# Altium project Spectre-Analyzer.PrjPcb
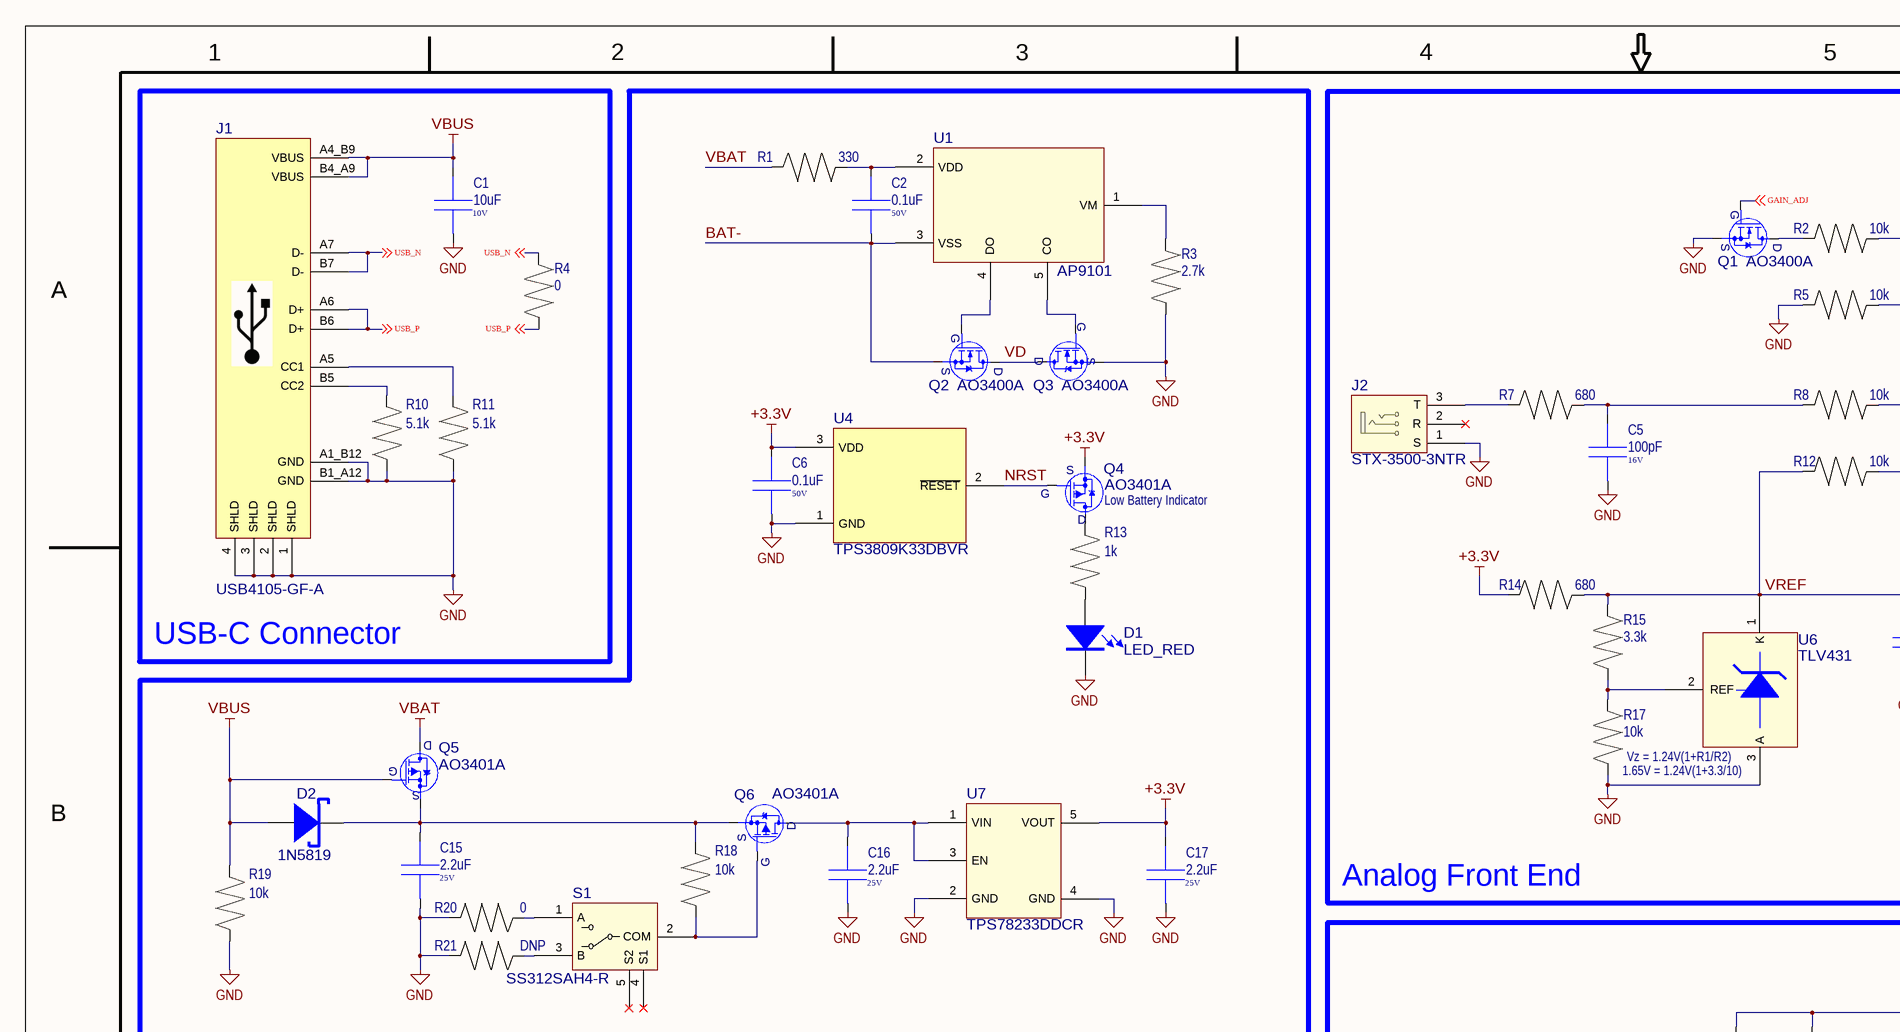
[diagram p0: Spectre-Analyzer-SCH_SH2_(C).SchDoc, top left]
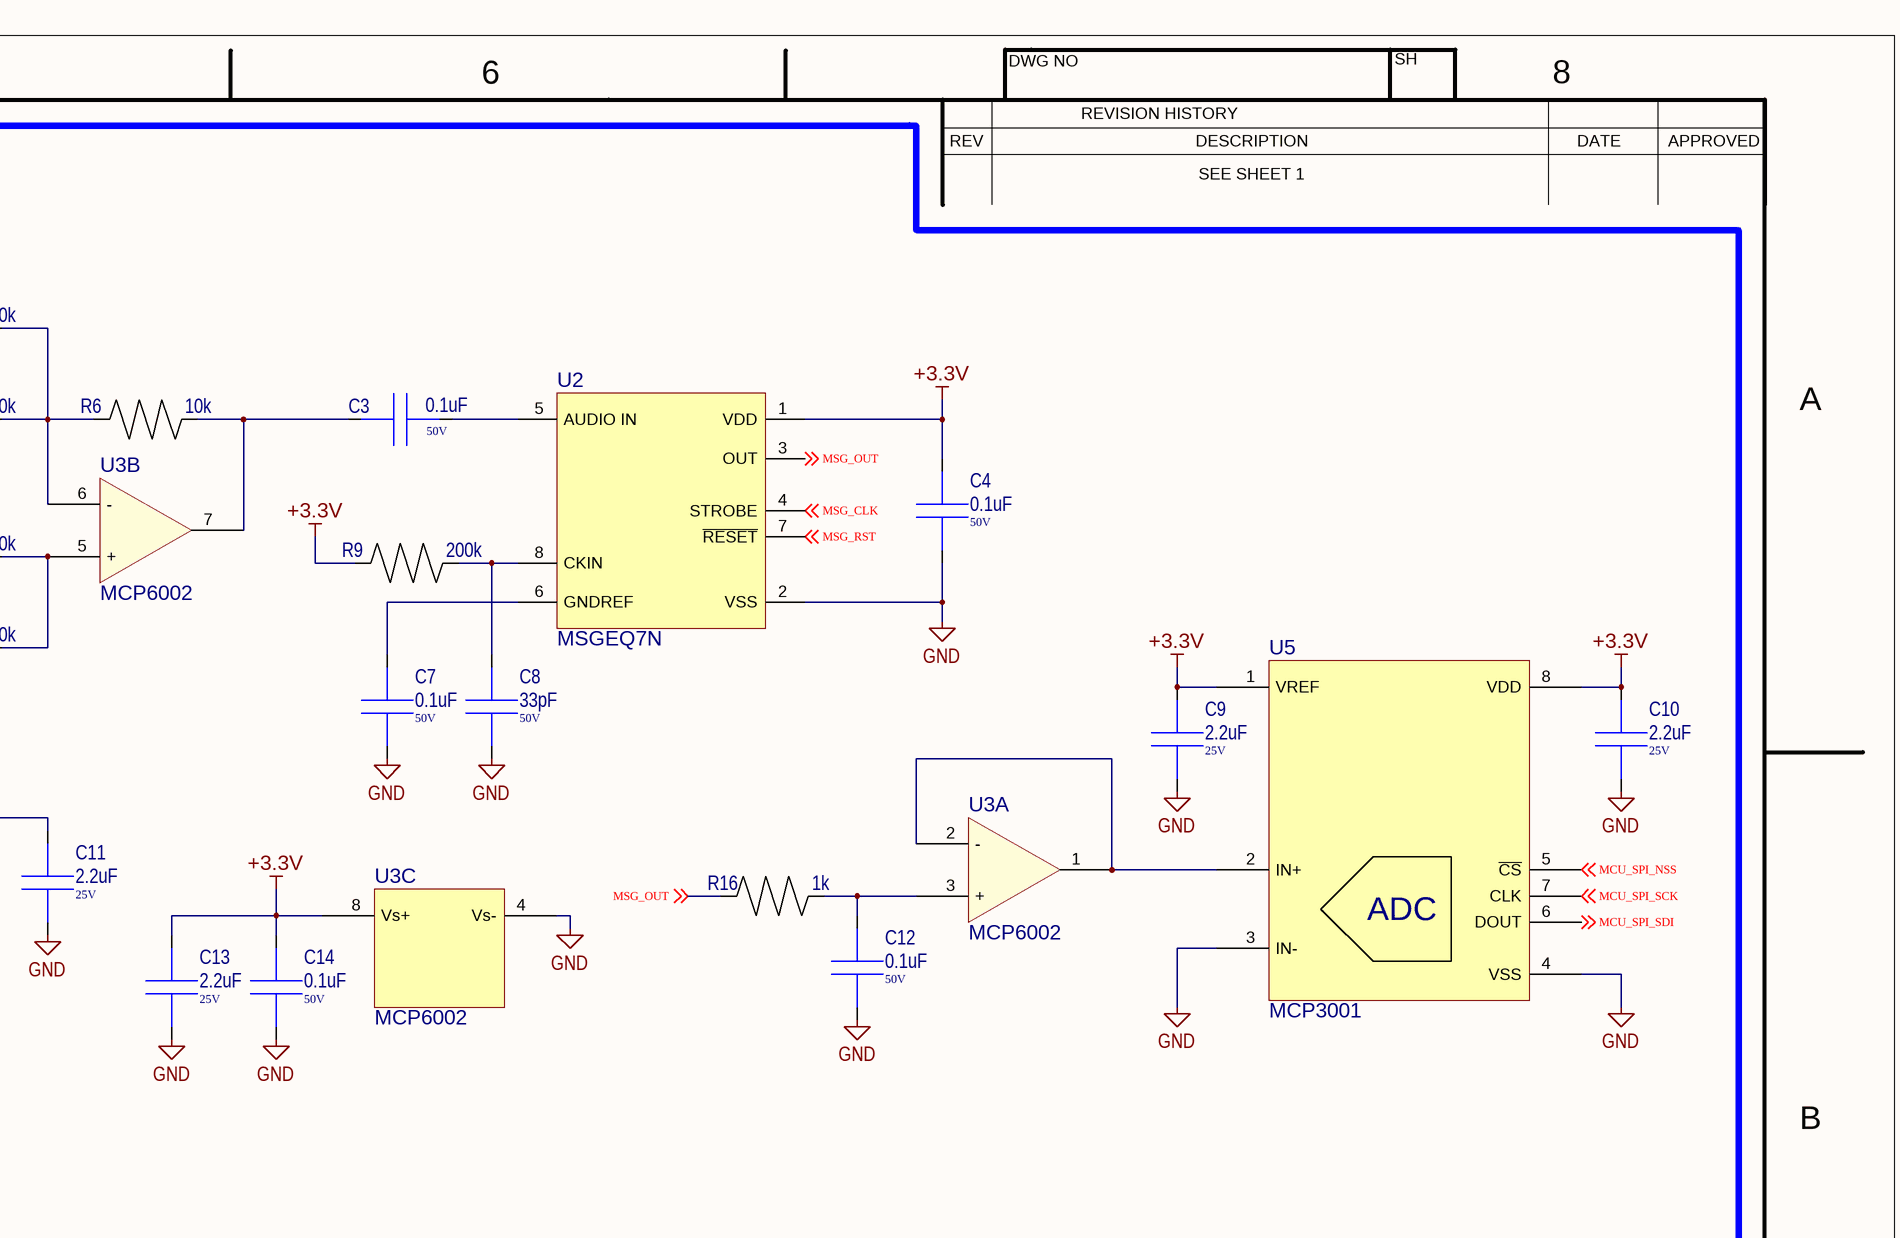
[diagram p1: Spectre-Analyzer-SCH_SH2_(C).SchDoc, top right]
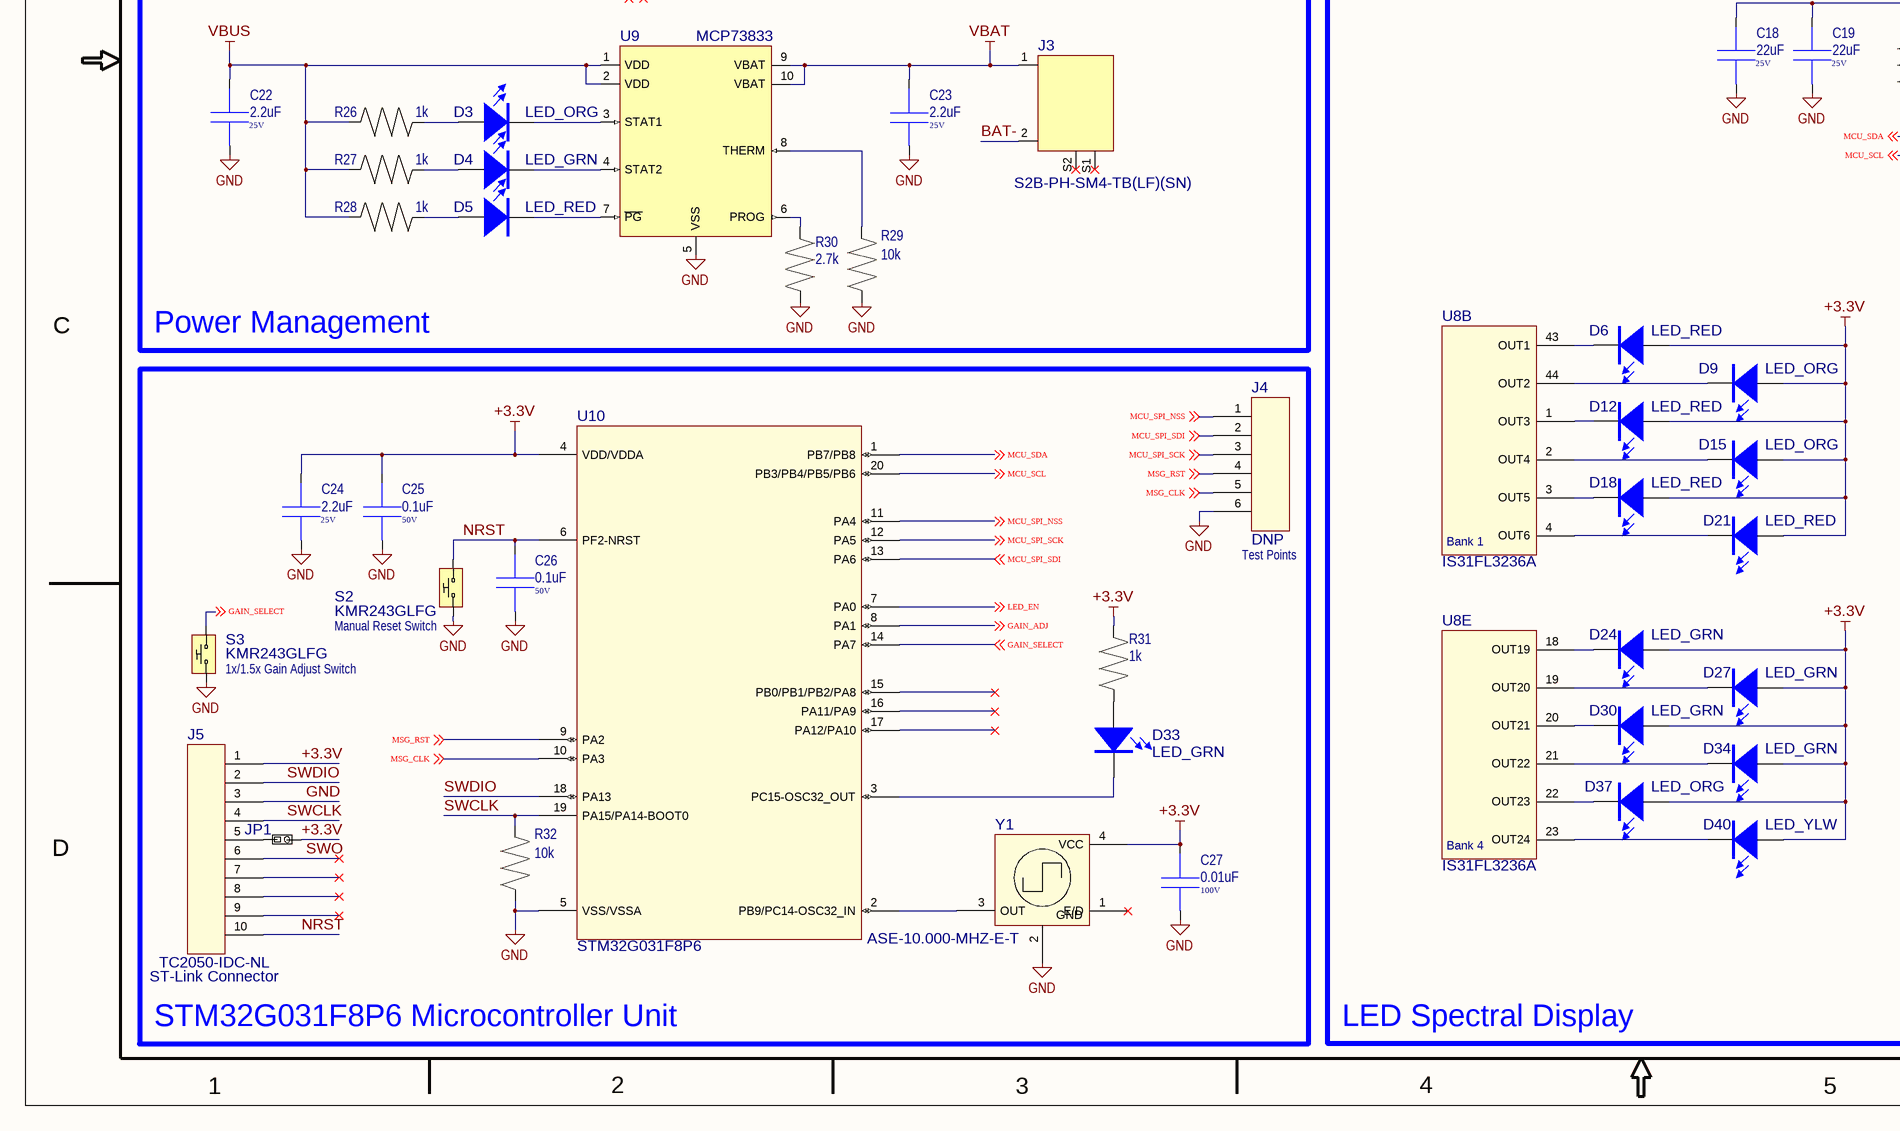
[diagram p2: Spectre-Analyzer-SCH_SH2_(C).SchDoc, bottom left]
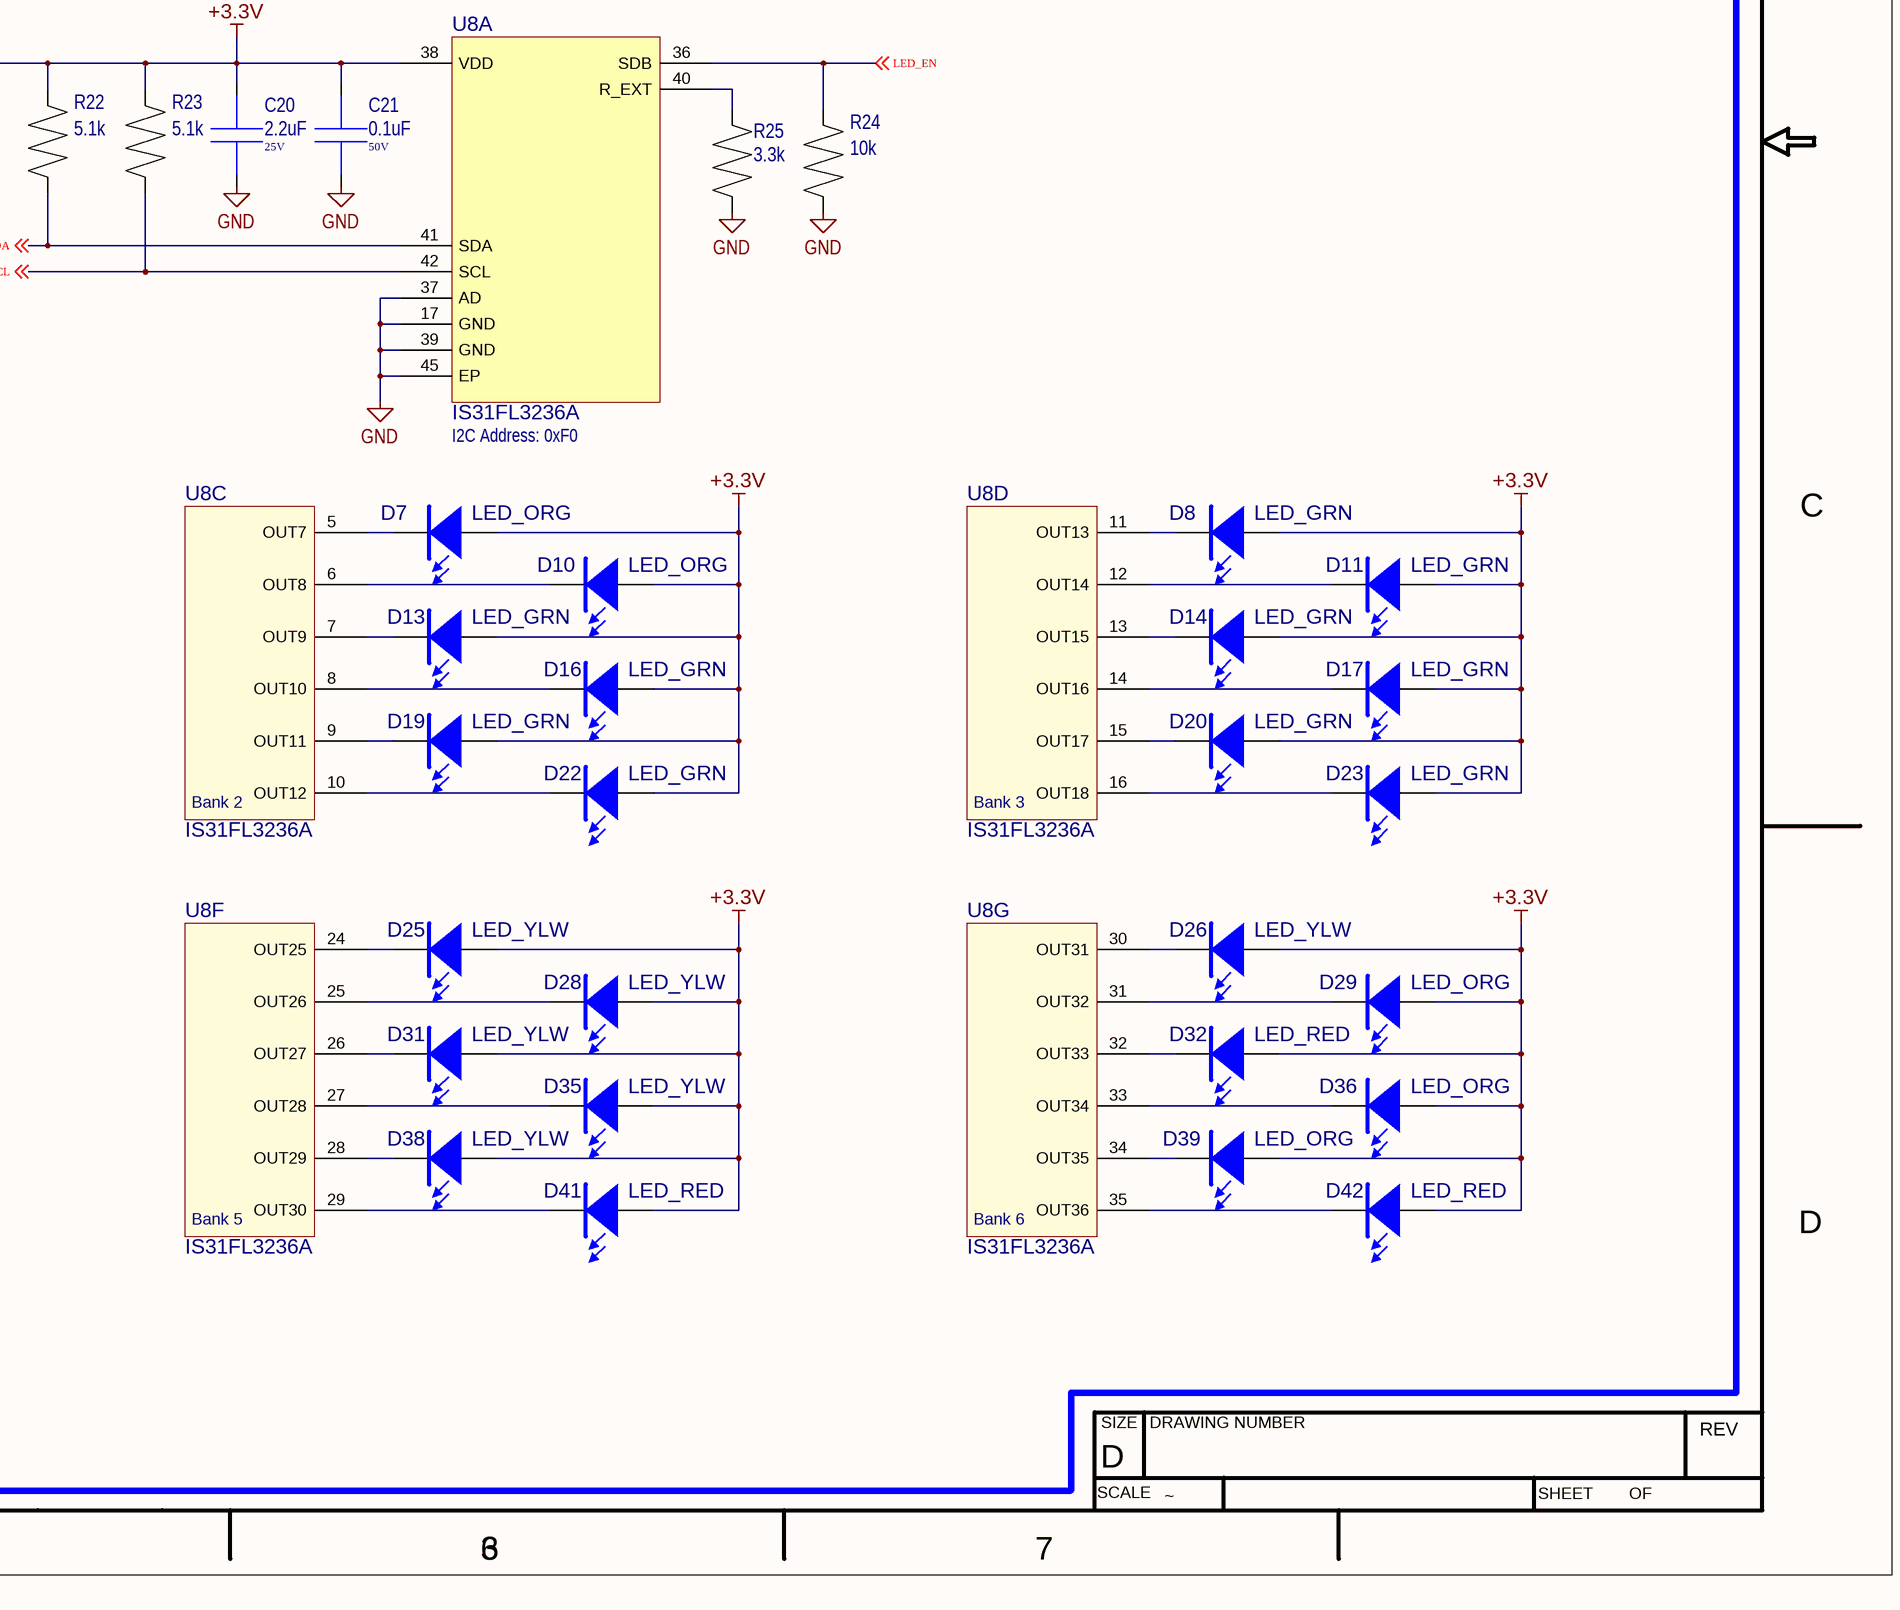
[diagram p3: Spectre-Analyzer-SCH_SH2_(C).SchDoc, bottom right]
Company: -; DateDftg: 10/16/2022; DateEng: 10/16/2022; DocNumber: Spectre; DocNumberPCB: Spectre-PCB; Hist1Appr: -; Hist1Date: 11/08/21; Hist1Desc: INITIAL PROTOTYPE DESIGN; Hist1Rev: A; Hist2Appr: -; Hist2Date: 01/06/2022; Hist2Desc: FORM FACTOR REDUCTION; Hist2Rev: B; Hist3Appr: -; Hist3Date: 10/16/2022; Hist3Desc: MICROCONTROLLER CHANGE; Hist3Rev: C; NameDftg: K. KIDD; NameEng: K. KIDD; Rev: C; Title0: Spectre; Title1: Audio Spectrum Analyzer; TitleCCA: CIRCUIT CARD ASSEMBLY,; TitlePCB: PRINTED CIRCUIT BOARD,; TitleSCH: SCHEMATIC, CCA,
1 sheet, 127 parts. Net scope: global (net labels, ports and power ports of the same name join across sheets).
Board file: Spectre-Analyzer.PcbDoc

## Sheet Spectre-Analyzer-SCH_SH2_(C).SchDoc: SCHEMATIC
size 863 x 558 mm; DocumentNumber: NIR-Spec-2; SheetNumber: 2; SheetTotal: 2; PageSetup: Record=PageOptions|CenterHorizontal=True|CenterVertical=True|PrintScale=0.98|XCorrection=1.00|YCorrection=1.00|PrintKind=2|BorderSize=5000000|LeftOffset=0|BottomOffset=0|Orientation=2|PaperLength=1000|PaperWidth=1000|Scale=100|PaperSource=15|PrintQuality=1200|MediaType=1|DitherType=10|PaperKind=11 x 17|PrintScaleMode=1

### Parts
C1  10uF  Voltage: 10V  [0402]
C2  0.1uF  Voltage: 50V  [0402]
C3  0.1uF  Voltage: 50V  [0402]
C4  0.1uF  Voltage: 50V  [0402]
C5  100pF  Voltage: 16V  [0402]
C6  0.1uF  Voltage: 50V  [0402]
C7  0.1uF  Voltage: 50V  [0402]
C8  33pF  Voltage: 50V  [0402]
C9  2.2uF  Voltage: 25V  [0402]
C10  2.2uF  Voltage: 25V  [0402]
C11  2.2uF  Voltage: 25V  [0402]
C12  0.1uF  Voltage: 50V  [0402]
C13  2.2uF  Voltage: 25V  [0402]
C14  0.1uF  Voltage: 50V  [0402]
C15  2.2uF  Voltage: 25V  [0402]
C16  2.2uF  Voltage: 25V  [0402]
C17  2.2uF  Voltage: 25V  [0402]
C18  22uF  Voltage: 25V  [0805]
C19  22uF  Voltage: 25V  [0805]
C20  2.2uF  Voltage: 25V  [0402]
C21  0.1uF  Voltage: 50V  [0402]
C22  2.2uF  Voltage: 25V  [0402]
C23  2.2uF  Voltage: 25V  [0402]
C24  2.2uF  Voltage: 25V  [0402]
C25  0.1uF  Voltage: 50V  [0402]
C26  0.1uF  Voltage: 50V  [0402]
C27  0.01uF  Voltage: 100V  [0402]
D1  LED_RED  [0603_LED_Red]
D2  1N5819  [SOD-123]
D3  LED_ORG  [0603_LED_Red]
D4  LED_GRN  [0603_LED_Red]
D5  LED_RED  [0603_LED_Red]
D6  LED_RED  [0603_LED_Red]
D7  LED_ORG  [0603_LED_Red]
D8  LED_GRN  [0603_LED_Red]
D9  LED_ORG  [0603_LED_Red]
D10  LED_ORG  [0603_LED_Red]
D11  LED_GRN  [0603_LED_Red]
D12  LED_RED  [0603_LED_Red]
D13  LED_GRN  [0603_LED_Red]
D14  LED_GRN  [0603_LED_Red]
D15  LED_ORG  [0603_LED_Red]
D16  LED_GRN  [0603_LED_Red]
D17  LED_GRN  [0603_LED_Red]
D18  LED_RED  [0603_LED_Red]
D19  LED_GRN  [0603_LED_Red]
D20  LED_GRN  [0603_LED_Red]
D21  LED_RED  [0603_LED_Red]
D22  LED_GRN  [0603_LED_Red]
D23  LED_GRN  [0603_LED_Red]
D24  LED_GRN  [0603_LED_Red]
D25  LED_YLW  [0603_LED_Red]
D26  LED_YLW  [0603_LED_Red]
D27  LED_GRN  [0603_LED_Red]
D28  LED_YLW  [0603_LED_Red]
D29  LED_ORG  [0603_LED_Red]
D30  LED_GRN  [0603_LED_Red]
D31  LED_YLW  [0603_LED_Red]
D32  LED_RED  [0603_LED_Red]
D33  LED_GRN  [0603_LED_Red]
D34  LED_GRN  [0603_LED_Red]
D35  LED_YLW  [0603_LED_Red]
D36  LED_ORG  [0603_LED_Red]
D37  LED_ORG  [0603_LED_Red]
D38  LED_YLW  [0603_LED_Red]
D39  LED_ORG  [0603_LED_Red]
D40  LED_YLW  [0603_LED_Red]
D41  LED_RED  [0603_LED_Red]
D42  LED_RED  [0603_LED_Red]
J1  USB4105-GF-A  [USB4105-GF-A]
J2  STX-3500-3NTR  [STX-3500-3NTR]
J3  S2B-PH-SM4-TB(LF)(SN)  [S2B-PH-SM4-TB(LF)(SN)]
J4  DNP  [801-43-006-10-012000]
J5  TC2050-IDC-NL  [TC2050-IDC-NL-FP]  (no BOM)
JP1  Solder Jumper  [SOLDER JUMPER]  (value not drawn)  (no BOM)
Q1  AO3400A  [SOT-23-3]
Q2  AO3400A  [SOT-23-3]
Q3  AO3400A  [SOT-23-3]
Q4  AO3401A  [SOT-23]
Q5  AO3401A  [SOT-23]
Q6  AO3401A  [SOT-23]
R1  330  [0402]
R2  10k  [0402]
R3  2.7k  [0402]
R4  0  [0402]
R5  10k  [0402]
R6  10k  [0402]
R7  680  [0402]
R8  10k  [0402]
R9  200k  [0402]
R10  5.1k  [0402]
R11  5.1k  [0402]
R12  10k  [0402]
R13  1k  [0402]
R14  680  [0402]
R15  3.3k  [0402]
R16  1k  [0402]
R17  10k  [0402]
R18  10k  [0402]
R19  10k  [0402]
R20  0  [0402]
R21  DNP  [0402]
R22  5.1k  [0402]
R23  5.1k  [0402]
R24  10k  [0402]
R25  3.3k  [0402]
R26  1k  [0402]
R27  1k  [0402]
R28  1k  [0402]
R29  10k  [0402]
R30  2.7k  [0402]
R31  1k  [0402]
R32  10k  [0402]
S1  SS312SAH4-R  [SW_SS312SAH4-R]
S2  KMR243GLFG  [KMR 2 Series]
S3  KMR243GLFG  [KMR 2 Series]
U1  AP9101  [TSOT23-5]
U2  MSGEQ7N  [SOIC-8]
U3  MCP6002  [SOIC-8]  (parts A,B,C of 3)
U4  TPS3809K33DBVR  [SOT-23-3]
U5  MCP3001  [SOIC-8]
U6  TLV431  [SOT-23-3]
U7  TPS78233DDCR  [TSOT23-5]
U8  IS31FL3236A  [QFN-44 5x5]  (parts A,B,C,D,E,F,G of 7)
U9  MCP73833  [MSOP-10]
U10  STM32G031F8P6  [TSSOP-20]
Y1  ASE-10.000-MHZ-E-T  [ASE-XXXXX-X-X-X]

### Blocks framed on the sheet
Power Management: C2 C6 C15-C17 C22 C23 D1-D5 J3 Q2-Q6 R1 R3 R13 R18-R21 R26-R30 S1 U1 U4 U7 U9
USB-C Connector: C1 J1 R4 R10 R11
Analog Front End: C3-C5 C7-C14 J2 Q1 R2 R5-R9 R12 R14-R17 U2 U3 U5 U6
LED Spectral Display: C18-C21 D6-D32 D34-D42 R22-R25 U8
STM32G031F8P6 Microcontroller Unit: C24-C27 D33 J4 J5 JP1 R31 R32 S2 S3 U10 Y1

### Nets
+3.3V: C4.2 C6.2 C9.2 C10.2 C13.2 C14.2 C17.2 C18.2 C19.2 C20.2 C21.2 C24.2 C25.2 C27.2 D6.1(A) D7.1(A) D8.1(A) D9.1(A) D10.1(A) D11.1(A) D12.1(A) D13.1(A) D14.1(A) D15.1(A) D16.1(A) D17.1(A) D18.1(A) D19.1(A) D20.1(A) D21.1(A) D22.1(A) D23.1(A) D24.1(A) D25.1(A) D26.1(A) D27.1(A) D28.1(A) D29.1(A) D30.1(A) D31.1(A) D32.1(A) D34.1(A) D35.1(A) D36.1(A) D37.1(A) D38.1(A) D39.1(A) D40.1(A) D41.1(A) D42.1(A) J5.1 JP1.2 Q4.3(S) R9.1 R14.1 R22.2 R23.2 R31.2 U2.1(VDD) U3.8(Vs+) U4.3(VDD) U5.1(VREF) U5.8(VDD) U7.5(VOUT) U8.38(VDD) U10.4(VDD/VDDA) Y1.4(VCC)
GND: C1.1 C4.1 C5.1 C6.1 C7.1 C8.1 C9.1 C10.1 C11.1 C12.1 C13.1 C14.1 C15.1 C16.1 C17.1 C18.1 C19.1 C20.1 C21.1 C22.1 C23.1 C24.1 C25.1 C26.1 C27.1 D1.2(K) J1.1(SHLD) J1.2(SHLD) J1.3(SHLD) J1.4(SHLD) J1.A1_B12(GND) J1.B1_A12(GND) J2.1(S) J4.6 J5.3 Q1.3(S) Q3.3(S) R3.2 R5.1 R10.1 R11.1 R17.2 R19.1 R20.2 R21.2 R24.1 R25.2 R29.1 R30.2 R32.1 S2.1 S3.1 U2.2(VSS) U3.4(Vs-) U4.1(GND) U5.3(IN-) U5.4(VSS) U6.3(A) U7.2(GND) U7.4(GND) U8.17(GND) U8.37(AD) U8.39(GND) U8.45(EP) U9.5(VSS) U10.5(VSS/VSSA) Y1.2(GND)
VBAT: C23.2 J3.1 Q5.2(D) R1.1 U9.9(VBAT) U9.10(VBAT)
VBUS: C1.2 C22.2 D2.1(A) J1.A4_B9(VBUS) J1.B4_A9(VBUS) Q5.1(G) R19.2 R26.1 R27.1 R28.1 U9.1(VDD) U9.2(VDD)
BAT-: C2.1 J3.2 Q2.3(S) U1.3(VSS)
GAIN_ADJ: Q1.1(G) U10.8(PA1) ; off-sheet GAIN_ADJ
GAIN_SELECT: S3.2 U10.14(PA7) ; off-sheet GAIN_SELECT
LED_EN: R24.2 U8.36(SDB) U10.7(PA0) ; off-sheet LED_EN
MCU_SCL: R23.1 U8.42(SCL) U10.20(PB3/PB4/PB5/PB6) ; off-sheet MCU_SCL
MCU_SDA: R22.1 U8.41(SDA) U10.1(PB7/PB8) ; off-sheet MCU_SDA
MCU_SPI_NSS: J4.1 U5.5(~{CS}) U10.11(PA4) ; off-sheet MCU_SPI_NSS
MCU_SPI_SCK: J4.3 U5.7(CLK) U10.12(PA5) ; off-sheet MCU_SPI_SCK
MCU_SPI_SDI: J4.2 U5.6(DOUT) U10.13(PA6) ; off-sheet MCU_SPI_SDI
MSG_CLK: J4.5 U2.4(STROBE) U10.10(PA3) ; off-sheet MSG_CLK
MSG_OUT: R16.1 U2.3(OUT) ; off-sheet MSG_OUT
MSG_RST: J4.4 U2.7(~{RESET}) U10.9(PA2) ; off-sheet MSG_RST
NRST: C26.2 J5.10 Q4.1(G) S2.2 U4.2(~{RESET}) U10.6(PF2-NRST)
SWCLK: J5.4 R32.2 U10.19(PA15/PA14-BOOT0)
SWDIO: J5.2 U10.18(PA13)
SWO: J5.6
USB_N: J1.A7(D-) J1.B7(D-) R4.1 ; off-sheet USB_N
USB_P: J1.A6(D+) J1.B6(D+) R4.2 ; off-sheet USB_P
VD: Q2.2(D) Q3.2(D)
VREF: C11.2 R12.1 R14.2 R15.1 U6.1(K)
NetC2_2: C2.2 R1.2 U1.2(VDD)
NetC3_1: C3.1 U2.5(AUDIO_IN)
NetC3_2: C3.2 R6.2 U3.7(OUT)
NetC5_2: C5.2 R7.2 R8.1
NetC7_2: C7.2 U2.6(GNDREF)
NetC8_2: C8.2 R9.2 U2.8(CKIN)
NetC12_2: C12.2 R16.2 U3.3(+)
NetC15_2: C15.2 D2.2(K) Q5.3(S) Q6.3(S) R18.2
NetC16_2: C16.2 Q6.2(D) U7.1(VIN) U7.3(EN)
NetD1_1: D1.1(A) R13.1
NetD3_1: D3.1(A) R26.2
NetD3_2: D3.2(K) U9.3(STAT1)
NetD4_1: D4.1(A) R27.2
NetD4_2: D4.2(K) U9.4(STAT2)
NetD5_1: D5.1(A) R28.2
NetD5_2: D5.2(K) U9.7(~{PG})
NetD6_2: D6.2(K) U8.43(OUT1)
NetD7_2: D7.2(K) U8.5(OUT7)
NetD8_2: D8.2(K) U8.11(OUT13)
NetD9_2: D9.2(K) U8.44(OUT2)
NetD10_2: D10.2(K) U8.6(OUT8)
NetD11_2: D11.2(K) U8.12(OUT14)
NetD12_2: D12.2(K) U8.1(OUT3)
NetD13_2: D13.2(K) U8.7(OUT9)
NetD14_2: D14.2(K) U8.13(OUT15)
NetD15_2: D15.2(K) U8.2(OUT4)
NetD16_2: D16.2(K) U8.8(OUT10)
NetD17_2: D17.2(K) U8.14(OUT16)
NetD18_2: D18.2(K) U8.3(OUT5)
NetD19_2: D19.2(K) U8.9(OUT11)
NetD20_2: D20.2(K) U8.15(OUT17)
NetD21_2: D21.2(K) U8.4(OUT6)
NetD22_2: D22.2(K) U8.10(OUT12)
NetD23_2: D23.2(K) U8.16(OUT18)
NetD24_2: D24.2(K) U8.18(OUT19)
NetD25_2: D25.2(K) U8.24(OUT25)
NetD26_2: D26.2(K) U8.30(OUT31)
NetD27_2: D27.2(K) U8.19(OUT20)
NetD28_2: D28.2(K) U8.25(OUT26)
NetD29_2: D29.2(K) U8.31(OUT32)
NetD30_2: D30.2(K) U8.20(OUT21)
NetD31_2: D31.2(K) U8.26(OUT27)
NetD32_2: D32.2(K) U8.32(OUT33)
NetD33_1: D33.1(A) R31.1
NetD33_2: D33.2(K) U10.3(PC15-OSC32_OUT)
NetD34_2: D34.2(K) U8.21(OUT22)
NetD35_2: D35.2(K) U8.27(OUT28)
NetD36_2: D36.2(K) U8.33(OUT34)
NetD37_2: D37.2(K) U8.22(OUT23)
NetD38_2: D38.2(K) U8.28(OUT29)
NetD39_2: D39.2(K) U8.34(OUT35)
NetD40_2: D40.2(K) U8.23(OUT24)
NetD41_2: D41.2(K) U8.29(OUT30)
NetD42_2: D42.2(K) U8.35(OUT36)
NetJ1_A5: J1.A5(CC1) R11.2
NetJ1_B5: J1.B5(CC2) R10.2
NetJ2_3: J2.3(T) R7.1
NetJ5_5: J5.5 JP1.1
NetQ1_2: Q1.2(D) R2.1
NetQ2_1: Q2.1(G) U1.4(DO)
NetQ3_1: Q3.1(G) U1.5(CO)
NetQ4_2: Q4.2(D) R13.2
NetQ6_1: Q6.1(G) R18.1 S1.2(COM)
NetR2_2: R2.2 R5.2 R6.1 U3.6(-)
NetR3_1: R3.1 U1.1(VM)
NetR8_2: R8.2 R12.2 U3.5(+)
NetR15_2: R15.2 R17.1 U6.2(REF)
NetR20_1: R20.1 S1.1(A)
NetR21_1: R21.1 S1.3(B)
NetR25_1: R25.1 U8.40(R_EXT)
NetR29_2: R29.2 U9.8(THERM)
NetR30_1: R30.1 U9.6(PROG)
NetU3_1: U3.1(OUT) U3.2(-) U5.2(IN+)
NetU10_2: U10.2(PB9/PC14-OSC32_IN) Y1.3(OUT)

Not connected (* = marked no-connect by the designer): J2 2(R)*; J3 S1* S2*; J5 7* 8* 9*; S1 4(S1)* 5(S2)*; U10 15(PB0/PB1/PB2/PA8)* 16(PA11/PA9)* 17(PA12/PA10)*; Y1 1(E/D)*

### Notes on the sheet
- 1
- 2
- 3
- 4
- 5
- 6
- DWG NO
- REVISION HISTORY
- SH
- 8
- REV
- DESCRIPTION
- SEE SHEET 1
- DATE
- APPROVED
- A
- Low Battery Indicator
- 1.65V = 1.24V(1+3.3/10)
- (near U6) Vz = 1.24V(1+R1/R2)
- B
- (near U8) I2C Address: 0xF0
- C
- (near J4) Test Points
- (near S2) Manual Reset Switch
- (near S3) 1x/1.5x Gain Adjust Switch
- D
- (near J5) ST-Link Connector
- SIZE
- DRAWING NUMBER
- SCALE
- ~
- SHEET        OF
- 7
- (in symbol IS31FL3236A, part B) Bank 1
- (in symbol IS31FL3236A, part C) Bank 2
- (in symbol IS31FL3236A, part D) Bank 3
- (in symbol IS31FL3236A, part E) Bank 4
- (in symbol IS31FL3236A, part F) Bank 5
- (in symbol IS31FL3236A, part G) Bank 6
- (in symbol MCP3001) ADC

### Library data of the parts
C1 = CAP: CAP CER 10UF 10V X5R 0402; Part Number: CL05A106MP5NUNC; Manufacturer: Samsung Electro-Mechanics; ClassName: -
C2-C4 C6 C7 C12 C14 C21 C25 C26 = CAP: CAP CER 0.1UF 50V X7R 0402; Part Number: UMK105B7104KVHF; Manufacturer: Taiyo Yuden; ClassName: Interface
C5 = CAP: CAP CER 100PF 16V X7R 0402; Part Number: VJ0402Y101KXJCW1BC; Manufacturer: Vishay Vitramon
C8 = CAP: CAP CER 33PF 50V X7R 0402; Part Number: 04025C330JAT2A; Manufacturer: KYOCERA AVX; ClassName: Interface
C9-C11 C13 C15-C17 C20 C22-C24 = CAP: CAP CER 2.2UF 25V X5R 0402; Part Number: GRM155R61E225KE11D; Manufacturer: Murata Electronics
  C15-C17 C22-C24: ClassName: Interface
C18 C19 = CAP: CAP CER 22UF 25V X5R 0805; Part Number: CL21A226MAYNNNE; Manufacturer: Samsung Electro-Mechanics; ClassName: *
C27 = CAP: CAP CER 0.01UF 100V X7R 0402; Part Number: HMR105B7103MV-F; Manufacturer: Taiyo Yuden; ClassName: Interface
D1 D5 D6 D12 D18 D21 D32 D41 D42 = LED_Red: Standard LEDs - SMD HE Red 645 nm Water Clear; Part Number: KT-0603R; Manufacturer: Hubei KENTO Elec; ClassName: Interface
D2 = DIODE_SCHOTTKY: DIODE SCHOTTKY 40V 1A SOD123; Manufacturer: Diodes Incorporated; Part Number: 1N5819HW-7-F; ClassName: Power Input
D3 D7 D9 D10 D15 D29 D36 D37 D39 = LED_Red: Standard LEDs - SMD HE Orange 598nm~608nm; Part Number: SZYY0603O; Manufacturer: Yongyu Photoelectric; ClassName: Interface
D4 D8 D11 D13 D14 D16 D17 D19 D20 D22-D24 D27 D33 D34 = LED_Red: Standard LEDs - SMD HE Green 518nm Water Clear; Part Number: 19-217/GHC-YR1S2/3T; Manufacturer: Everlight Elec; ClassName: Interface
D25 D26 D28 D31 D35 D38 D40 = LED_Red: Standard LEDs - SMD HE Yellow 585nm Water Clear; Part Number: 19-213/Y2C-CQ2R2L/3T(CY); Manufacturer: Everlight Elec; ClassName: Interface
D30 = LED_Red: Standard LEDs - SMD HE Red 645 nm Water Clear; Part Number: 19-213/Y2C-CQ2R2L/3T(CY); Manufacturer: Everlight Elec; ClassName: Interface
J1 = USB4105-GF-A: CONN RCP USB2.0 TYP C 24P SMD RA; Manufacturer: GCT; Part Number: USB4105-GF-A
J2 = STX-3500-3NTR: CONN JACK STEREO 3.5MM SMD R/A; Manufacturer: Kycon, Inc.; Part Number: STX-3500-3NTR
J3 = S2B-PH-SM4-TB(LF)(SN): CONN HEADER SMD R/A 2POS 2MM; Manufacturer: JST Sales America Inc.; Part Number: S2B-PH-SM4-TB(LF)(SN)
J4 = 801-43-006-10-012000: CONN SOCKET STRIP 6 POS 0.1"; Manufacturer: Mill-Max; Part Number: 801-43-006-10-012000
J5 = TC2050-IDC-NL: CBL PLUG-OF-NAILS 10-PIN; Manufacturer: Tag-Connect LLC; Part Number: TC2050-IDC-NL
JP1 = SolderJumper_Single: Solder Jumper Single 0.5mm Pitch
Q1-Q3 = MOSFET_N: MOSFET N-CH 30V 5.7A SOT23-3L; Manufacturer: Alpha & Omega Semiconductor Inc.; Part Number: AO3400A
Q4-Q6 = MOSFET_P: MOSFET P-CH 30V 4A SOT23-3L; Manufacturer: Alpha & Omega Semiconductor Inc.; Part Number: AO3401A; ClassName: Power Input
R1 = RES: RES 330 OHM 1% 1/16W 0402; Part Number: CR0402AFX-3300GLF; Manufacturer: Bourns
R2 R5 R6 R8 R12 R17-R19 R24 R29 R32 = RES: RES SMD 10K OHM 1% 1/16W 0402; Part Number: CR0402-FX-1002GLF; Manufacturer: Bourns
  R18 R19 R24 R29 R32: ClassName: Power Input
R3 R30 = RES: RES SMD 2.7K OHM 1% 1/16W 0402; Part Number: CR0402-FX-2701GLF; Manufacturer: Bourns; ClassName: Interface
R4 R20 R21 = RES: Thick Film Resistors - SMD 1/16watt 0ohm Commercial Use; Part Number: CRCW04020000Z0EDC; Manufacturer: Vishay / Dale; ClassName: -
R7 R14 = RES: RES SMD 680 OHM 1% 1/16W 0402; Part Number: CR0402-FX-6800GLF; Manufacturer: Bourns
R9 = RES: RES SMD 200K OHM 1% 1/16W 0402; Part Number: CR0402-FX-2003GLF; Manufacturer: Bourns
R10 R11 R22 R23 = RES: RES SMD 5.1K OHM 1% 1/16W 0402; Part Number: CRCW04025K10FKED; Manufacturer: Vishay / Dale; ClassName: -
R13 = RES: RES SMD 1K OHM 1% 1/16W 0402; Part Number: CR0402-FX-1001GLF; Manufacturer: Bourns; ClassName: Power Input
R15 R25 = RES: RES SMD 3.3K OHM 1% 1/16W 0402; Part Number: CR0402-FX-3301GLF; Manufacturer: Bourns
R16 R26-R28 R31 = RES: RES 1K OHM 1% 1/16W 0402; Part Number: CR0402AFX-1001GLF; Manufacturer: Bourns
  R31: ClassName: Interface
S1 = SS312SAH4-R: SWITCH SLIDE SPDT 0.4VA 28V; Manufacturer: NKK Switches; Part Number: SS312SAH4-R
S2 S3 = KMR 2 Series: SWITCH TACTILE SPST-NO 0.01A 32V; Manufacturer: C&K; Part Number: KMR243GLFG
U1 = AP9101CAK-AKTRG1: IC BATT PROT LI-ION 1CELL SOT25; Manufacturer: Diodes Incorporated; Part Number: AP9101CAK-AKTRG1
U2 = MSGEQ7: SWITCHED CAPA AUDIO ANALYZER SOIC-8; Manufacturer: Mixed Signal Integrated; Part Number: MSGEQ7N
U3 = AD8072: IC OPAMP GP 2 CIRCUIT 8SOIC; Part Number: MCP6002-E/SN; Manufacturer: Microchip Technology
U4 = TPS3809x: IC SUPERVISOR 1 CHANNEL SOT23-3; Manufacturer: Texas Instruments; Part Number: TPS3809K33DBVR
U5 = MCP3001: IC ADC 10BIT SAR 8SOIC; Manufacturer: Microchip Technology; Part Number: MCP3001T-I/SN
U6 = TL431xxDBZR: IC VREF SHUNT ADJ SOT23-3; Manufacturer: onsemi; Part Number: TLV431ASN1T1G
U7 = TPS782xxDDCR: IC REG LINEAR 3.3V 150MA SOT23-5; Manufacturer: Texas Instruments; Part Number: TPS78233DDCR
U8 = IS31FL3236A: IC LED DRIVER LINEAR 38MA 44QFN; Manufacturer: Lumissil Microsystems; Part Number: IS31FL3236A-QFLS2-TR
U9 = MCP73833: IC BATT CNTRL LI-ION 1CEL 10MSOP; Part Number: MCP73833-CNI/UN; Manufacturer: Microchip
U10 = STM32G031FxP6: IC MCU 32BIT 64KB FLASH 20TSSOP; Manufacturer: STMicroelectronics; Part Number: STM32G031F8P6
Y1 = ASE-XXXXX-MHZ-X-X: OSC XO 10.000MHZ CMOS SMD; Manufacturer: Abracon; Part Number: ASE-10.000-MHZ-E-T; ClassName: Interface